# EAGLE design 3-Axis CNC Board v1.1_OSHPAK (EAGLE 6.5.0)
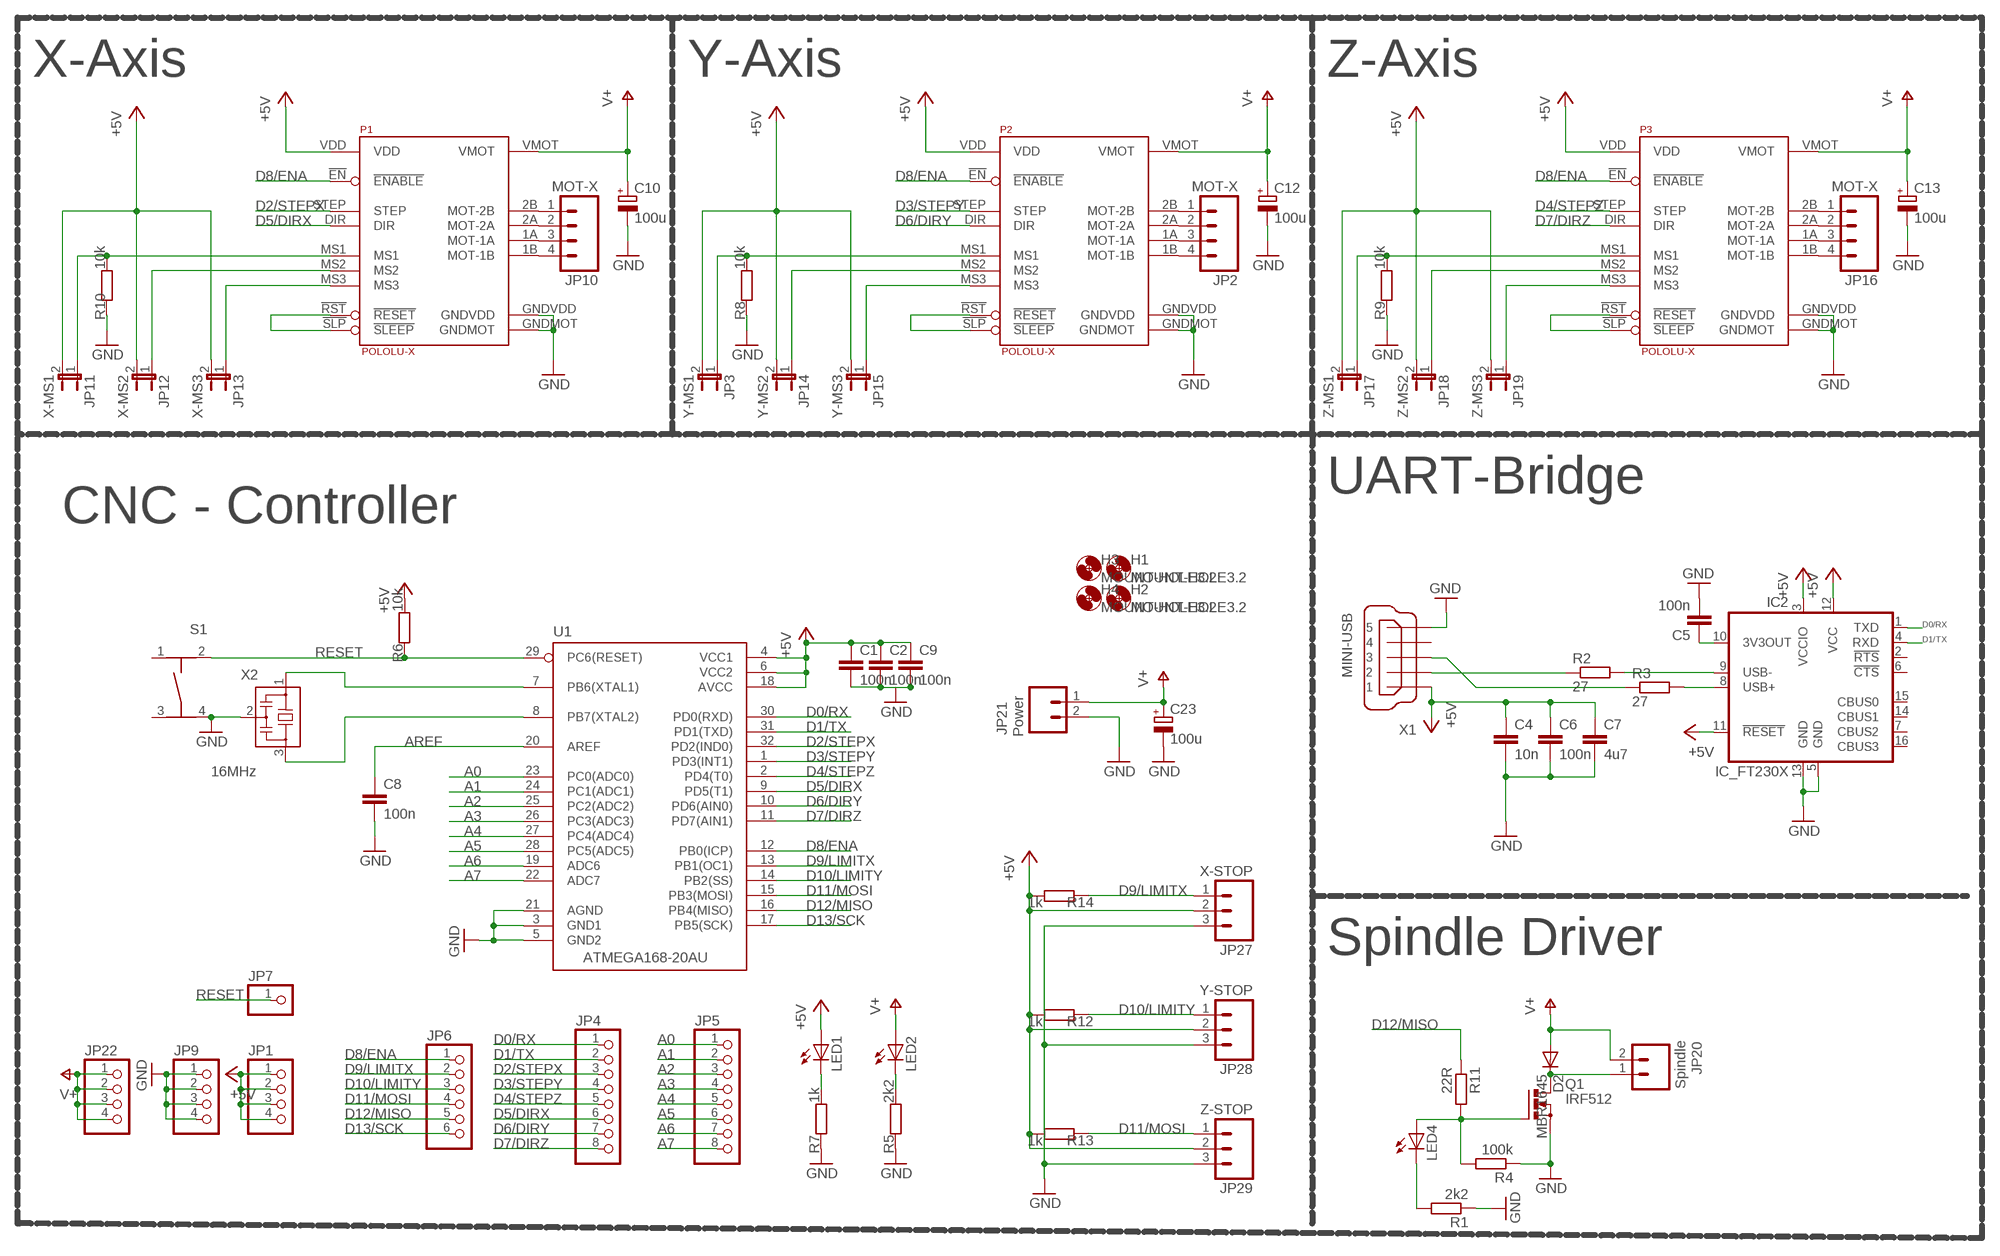
[diagram p0: schematic, sheet 1]

## Parts
C1  100n  C-EUC0805K  [C0805K]
C2  100n  C-EUC0805K  [C0805K]
C4  10n  C-EUC0805K  [C0805K]
C5  100n  C-EUC0805K  [C0805K]
C6  100n  C-EUC0805K  [C0805K]
C7  4u7  C-EUC0805K  [C0805K]
C8  100n  C-EUC0805K  [C0805K]
C9  100n  C-EUC0805K  [C0805K]
C10  100u  CPOL-EUUD-6,3X7,7  [UD-6,3X7,7_NICHICON]
C12  100u  CPOL-EUUD-6,3X7,7  [UD-6,3X7,7_NICHICON]
C13  100u  CPOL-EUUD-6,3X7,7  [UD-6,3X7,7_NICHICON]
C23  100u  CPOL-EUUD-6,3X7,7  [UD-6,3X7,7_NICHICON]
D2  MBR1645  BYT08P  [TO220ACS]
H1  MOUNT-HOLE3.2  [3,2]
H2  MOUNT-HOLE3.2  [3,2]
H3  MOUNT-HOLE3.2  [3,2]
H4  MOUNT-HOLE3.2  [3,2]
IC2  IC_FT230X  IC_FT230X-SSOP-16  [SSOP-16-FTDI]
JP1  PINHD-1X4_2.54  [1X04]
JP2  MOT-X  M04POLAR  [MOLEX-1X4]
JP3  Y-MS1  JUMPER-2PTH  [1X02]
JP4  PINHD-1X8_2.54  [1X08]
JP5  PINHD-1X8_2.54  [1X08]
JP6  PINHD-1X6_2.54  [1X06]
JP7  PINHD-1X1  [1X01]
JP9  PINHD-1X4_2.54  [1X04]
JP10  MOT-X  M04POLAR  [MOLEX-1X4]
JP11  X-MS1  JUMPER-2PTH  [1X02]
JP12  X-MS2  JUMPER-2PTH  [1X02]
JP13  X-MS3  JUMPER-2PTH  [1X02]
JP14  Y-MS2  JUMPER-2PTH  [1X02]
JP15  Y-MS3  JUMPER-2PTH  [1X02]
JP16  MOT-X  M04POLAR  [MOLEX-1X4]
JP17  Z-MS1  JUMPER-2PTH  [1X02]
JP18  Z-MS2  JUMPER-2PTH  [1X02]
JP19  Z-MS3  JUMPER-2PTH  [1X02]
JP20  Spindle  M025MM  [SCREWTERMINAL-5MM-2]
JP21  Power  M025MM  [SCREWTERMINAL-5MM-2]
JP22  PINHD-1X4_2.54  [1X04]
JP27  X-STOP  M03POLAR  [MOLEX-1X3]
JP28  Y-STOP  M03POLAR  [MOLEX-1X3]
JP29  Z-STOP  M03POLAR  [MOLEX-1X3]
LED1  LEDCHIPLED_1206  [CHIPLED_1206]
LED2  LEDCHIPLED_1206  [CHIPLED_1206]
LED4  LEDCHIPLED_1206  [CHIPLED_1206]
P1  POLOLU-X  POLOLU-ALLEGRO  [POLOLU-ALLEGRO-PTH]
P2  POLOLU-X  POLOLU-ALLEGRO  [POLOLU-ALLEGRO-PTH]
P3  POLOLU-X  POLOLU-ALLEGRO  [POLOLU-ALLEGRO-PTH]
Q1  IRF512  [TO220BV]
R1  2k2  R-EU_R1206  [R1206]
R2  27  R-EU_R1206  [R1206]
R3  27  R-EU_R1206  [R1206]
R4  100k  R-EU_R1206  [R1206]
R5  2k2  R-EU_R1206  [R1206]
R6  10k  R-EU_R1206  [R1206]
R7  1k  R-EU_R1206  [R1206]
R8  10k  R-EU_R1206  [R1206]
R9  10k  R-EU_R1206  [R1206]
R10  10k  R-EU_R1206  [R1206]
R11  22R  R-EU_R1206  [R1206]
R12  1k  R-EU_R1206  [R1206]
R13  1k  R-EU_R1206  [R1206]
R14  1k  R-EU_R1206  [R1206]
S1  TASTER-9314_SMD  [TASTER-9314_SMD]
U1  ATMEGA168-20AU  [QFP032]
X1  MINI-USB  MINI-USB-32005-021-NODRILL  [32005-201_1]
X2  16MHz  CSTCE_G8M00G52A  [CSTCE_]

## Nets
+5V: C1.1 C2.1 C4.1 C6.1 C7.1 C9.1 IC2.3(VCCIO) IC2.11(!RESET) IC2.12(VCC) JP1.1 JP1.2 JP1.3 JP1.4 JP3.2 JP11.2 JP12.2 JP13.2 JP14.2 JP15.2 JP17.2 JP18.2 JP19.2 JP27.2 JP28.2 JP29.2 LED1.A P1.VDD P2.VDD P3.VDD R6.2 R12.2 R13.2 R14.2 U1.4(VCC1) U1.6(VCC2) U1.18(AVCC) X1.1
A0: JP5.1 U1.23(PC0(ADC0))
A1: JP5.2 U1.24(PC1(ADC1))
A2: JP5.3 U1.25(PC2(ADC2))
A3: JP5.4 U1.26(PC3(ADC3))
A4: JP5.5 U1.27(PC4(ADC4))
A5: JP5.6 U1.28(PC5(ADC5))
A6: JP5.7 U1.19(ADC6)
A7: JP5.8 U1.22(ADC7)
AREF: C8.1 U1.20(AREF)
D0/RX: IC2.1(TXD) JP4.1 U1.30(PD0(RXD))
D1/TX: IC2.4(RXD) JP4.2 U1.31(PD1(TXD))
D2/STEPX: JP4.3 P1.STEP U1.32(PD2(IND0))
D3/STEPY: JP4.4 P2.STEP U1.1(PD3(INT1))
D4/STEPZ: JP4.5 P3.STEP U1.2(PD4(T0))
D5/DIRX: JP4.6 P1.DIR U1.9(PD5(T1))
D6/DIRY: JP4.7 P2.DIR U1.10(PD6(AIN0))
D7/DIRZ: JP4.8 P3.DIR U1.11(PD7(AIN1))
D8/ENA: JP6.1 P1.!EN(!ENABLE) P2.!EN(!ENABLE) P3.!EN(!ENABLE) U1.12(PB0(ICP))
D9/LIMITX: JP6.2 JP27.1 R14.1 U1.13(PB1(OC1))
D10/LIMITY: JP6.3 JP28.1 R12.1 U1.14(PB2(SS))
D11/MOSI: JP6.4 JP29.1 R13.1 U1.15(PB3(MOSI))
D12/MISO: JP6.5 R11.1 U1.16(PB4(MISO))
D13/SCK: JP6.6 U1.17(PB5(SCK))
D+: IC2.8(USB+) R3.2
D-: IC2.9(USB-) R2.2
GND: C1.2 C2.2 C4.2 C5.2 C6.2 C7.2 C8.2 C9.2 C10.- C12.- C13.- C23.- IC2.5(GND) IC2.13(GND) JP9.1 JP9.2 JP9.3 JP9.4 JP21.2 JP27.3 JP28.3 JP29.3 P1.GNDMOT P1.GNDVDD P2.GNDMOT P2.GNDVDD P3.GNDMOT P3.GNDVDD Q1.S R1.1 R4.1 R5.1 R7.1 R8.1 R9.1 R10.1 S1.4 U1.3(GND1) U1.5(GND2) U1.21(AGND) X1.5 X2.2
N$1: U1.8(PB7(XTAL2)) X2.3
N$2: U1.7(PB6(XTAL1)) X2.1
N$4: R3.1 X1.3
N$5: D2.C JP20.1 Q1.D
N$7: LED1.C R7.2
N$8: C5.1 IC2.10(3V3OUT)
N$9: R2.1 X1.2
N$10: LED4.C R1.2
N$11: LED4.A Q1.G R4.2 R11.2
N$17: LED2.C R5.2
RESET: JP7.1 R6.1 S1.2 U1.29(PC6(RESET))
V+: C10.+ C12.+ C13.+ C23.+ D2.A JP20.2 JP21.1 JP22.1 JP22.2 JP22.3 JP22.4 LED2.A P1.VMOT P2.VMOT P3.VMOT
X-MOT-1A [power]: JP10.3 P1.1A(MOT-1A)
X-MOT-1A1 [power]: JP2.3 P2.1A(MOT-1A)
X-MOT-1A2 [power]: JP16.3 P3.1A(MOT-1A)
X-MOT-1B [power]: JP10.4 P1.1B(MOT-1B)
X-MOT-1B1 [power]: JP2.4 P2.1B(MOT-1B)
X-MOT-1B2 [power]: JP16.4 P3.1B(MOT-1B)
X-MOT-2A [power]: JP10.2 P1.2A(MOT-2A)
X-MOT-2A1 [power]: JP2.2 P2.2A(MOT-2A)
X-MOT-2A2 [power]: JP16.2 P3.2A(MOT-2A)
X-MOT-2B [power]: JP10.1 P1.2B(MOT-2B)
X-MOT-2B1 [power]: JP2.1 P2.2B(MOT-2B)
X-MOT-2B2 [power]: JP16.1 P3.2B(MOT-2B)
X-MS1: JP11.1 P1.MS1 R10.2
X-MS2: JP12.1 P1.MS2
X-MS3: JP13.1 P1.MS3
X-MS4: JP14.1 P2.MS2
X-MS5: JP15.1 P2.MS3
X-MS6: JP3.1 P2.MS1 R8.2
X-MS7: JP18.1 P3.MS2
X-MS8: JP19.1 P3.MS3
X-MS9: JP17.1 P3.MS1 R9.2
X-RESETSLEEP: P1.!RST(!RESET) P1.!SLP(!SLEEP)
X-RESETSLEEP1: P2.!RST(!RESET) P2.!SLP(!SLEEP)
X-RESETSLEEP2: P3.!RST(!RESET) P3.!SLP(!SLEEP)
Unconnected: IC2.2(!RTS) IC2.6(!CTS) IC2.7(CBUS2) IC2.14(CBUS1) IC2.15(CBUS0) IC2.16(CBUS3) S1.1 S1.3 X1.4

## Notes on the sheet
- X-Axis | Y-Axis | Z-Axis
- UART-Bridge
- CNC - Controller
- Spindle Driver

## Library data of the parts
C1 C2 C4-C9 = rcl:C-EU: CAPACITOR, European symbol
C10 C12 C13 C23 = rcl:CPOL-EU: POLARIZED CAPACITOR, European symbol
D2 = diode:BYT08P: DIODE ultra fast
H1-H4 = holes:MOUNT-HOLE: MOUNTING HOLE with drill center marker
IC2 = dp_devices:IC_FT230X: BASIC USB to UART IC
JP1 JP9 JP22 = pinhead-1:PINHD-1X4: PIN HEADER
JP2 JP10 JP16 = SparkFun:M04: Header 4 Standard 4-pin 0.1" header. Use with straight break away headers (SKU : PRT-00116), right angle break away headers (PRT-00553), swiss pins (PRT-00743), machine pins (PRT-00117), and female headers (PRT-00115). Molex polarized connector foot print use with SKU : PRT-08231 with associated crimp pins and housings.
JP3 JP11-JP15 JP17-JP19 = SparkFun:JUMPER-2: Jumper Basic 0.1" spaced jumper. Use with breakaway headers.
JP4 JP5 = pinhead-1:PINHD-1X8: PIN HEADER
JP6 = pinhead-1:PINHD-1X6: PIN HEADER
JP7 = pinhead:PINHD-1X1: PIN HEADER
JP20 JP21 = SparkFun-Connectors:M02: Standard 2-pin 0.1" header. Use with - straight break away headers ( PRT-00116) - right angle break away headers (PRT-00553) - swiss pins (PRT-00743) - machine pins (PRT-00117) - female headers (PRT-00115) Molex polarized connector foot print use with: PRT-08233 with associated crimp pins and housings. 2.54_SCREWTERM for use with PRT-10571. 3.5mm Screw Terminal footprints for PRT-08084 5mm Screw Terminal footprints for use with PRT-08433
JP27-JP29 = SparkFun:M03: Header 3 Standard 3-pin 0.1" header. Use with straight break away headers (SKU : PRT-00116), right angle break away headers (PRT-00553), swiss pins (PRT-00743), machine pins (PRT-00117), and female headers (PRT-00115). Molex polarized connector foot print use with SKU : PRT-08232 with associated crimp pins and housings.
LED1 LED2 LED4 = led:LED: LED OSRAM: - CHIPLED LG R971, LG N971, LY N971, LG Q971, LY Q971, LO R971, LY R971 LH N974, LH R974 LS Q976, LO Q976, LY Q976 LO Q996 - Hyper CHIPLED LW Q18S LB Q993, LB Q99A, LB R99A - SideLED LS A670, LO A670, LY A670, LG A670, LP A670 LB A673, LV A673, LT A673, LW A673 LH A674 LY A675 LS A676, LA A676, LO A676, LY A676, LW A676 LS A679, LY A679, LG A679 - Hyper Micro SIDELED® LS Y876, LA Y876, LO Y876, LY Y876 LT Y87S - SmartLED LW L88C, LW L88S LB L89C, LB L89S, LG L890 LS L89K, LO L89K, LY L89K LS L896, LA L896, LO L896, LY L896 - TOPLED LS T670, LO T670, LY T670, LG T670, LP T670 LSG T670, LSP T670, LSY T670, LOP T670, LYG T670 LG T671, LOG T671, LSG T671 LB T673, LV T673, LT T673, LW T673 LH T674 LS T676, LA T676, LO T676, LY T676, LB T676, LH T676, LSB T676, LW T676 LB T67C, LV T67C, LT T67C, LS T67K, LO T67K, LY T67K, LW E67C LS E67B, LA E67B, LO E67B, LY E67B, LB E67C, LV E67C, LT E67C LW T67C LS T679, LY T679, LG T679 LS T770, LO T770, LY T770, LG T770, LP T770 LB T773, LV T773, LT T773, LW T773 LH T774 LS E675, LA E675, LY E675, LS T675 LS T776, LA T776, LO T776, LY T776, LB T776 LHGB T686 LT T68C, LB T68C - Hyper Mini TOPLED® LB M676 - Mini TOPLED Santana® LG M470 LS M47K, LO M47K, LY M47K Source: http://www.osram.convergy.de LUXEON: - LUMILED® LXK2-PW12-R00, LXK2-PW12-S00, LXK2-PW14-U00, LXK2-PW14-V00 LXK2-PM12-R00, LXK2-PM12-S00, LXK2-PM14-U00 LXK2-PE12-Q00, LXK2-PE12-R00, LXK2-PE12-S00, LXK2-PE14-T00, LXK2-PE14-U00 LXK2-PB12-K00, LXK2-PB12-L00, LXK2-PB12-M00, LXK2-PB14-N00, LXK2-PB14-P00, LXK2-PB14-Q00 LXK2-PR12-L00, LXK2-PR12-M00, LXK2-PR14-Q00, LXK2-PR14-R00 LXK2-PD12-Q00, LXK2-PD12-R00, LXK2-PD12-S00 LXK2-PH12-R00, LXK2-PH12-S00 LXK2-PL12-P00, LXK2-PL12-Q00, LXK2-PL12-R00 Source: www.luxeon.com KINGBRIGHT: KA-3528ASYC Source: www.kingbright.com
P1-P3 = pololu-allegro:POLOLU-ALLEGRO
Q1 = transistor-power:IRF512: N-CHANNEL MOS FET
R1-R14 = rcl:R-EU_: RESISTOR, European symbol
S1 = SMD-taster:TASTER-9314_SMD
U1 = MySMD:ATMEGA168-20AU
X1 = con-cypressindustries:MINI-USB-: MINI USB-B Conector Source: www.cypressindustries.com
X2 = DragonLib:CSTCE_G: Resonator Source: murata.co.jp; MPN: CSTCE8M00G52-R0; OC_RS: 721-4827

## Board
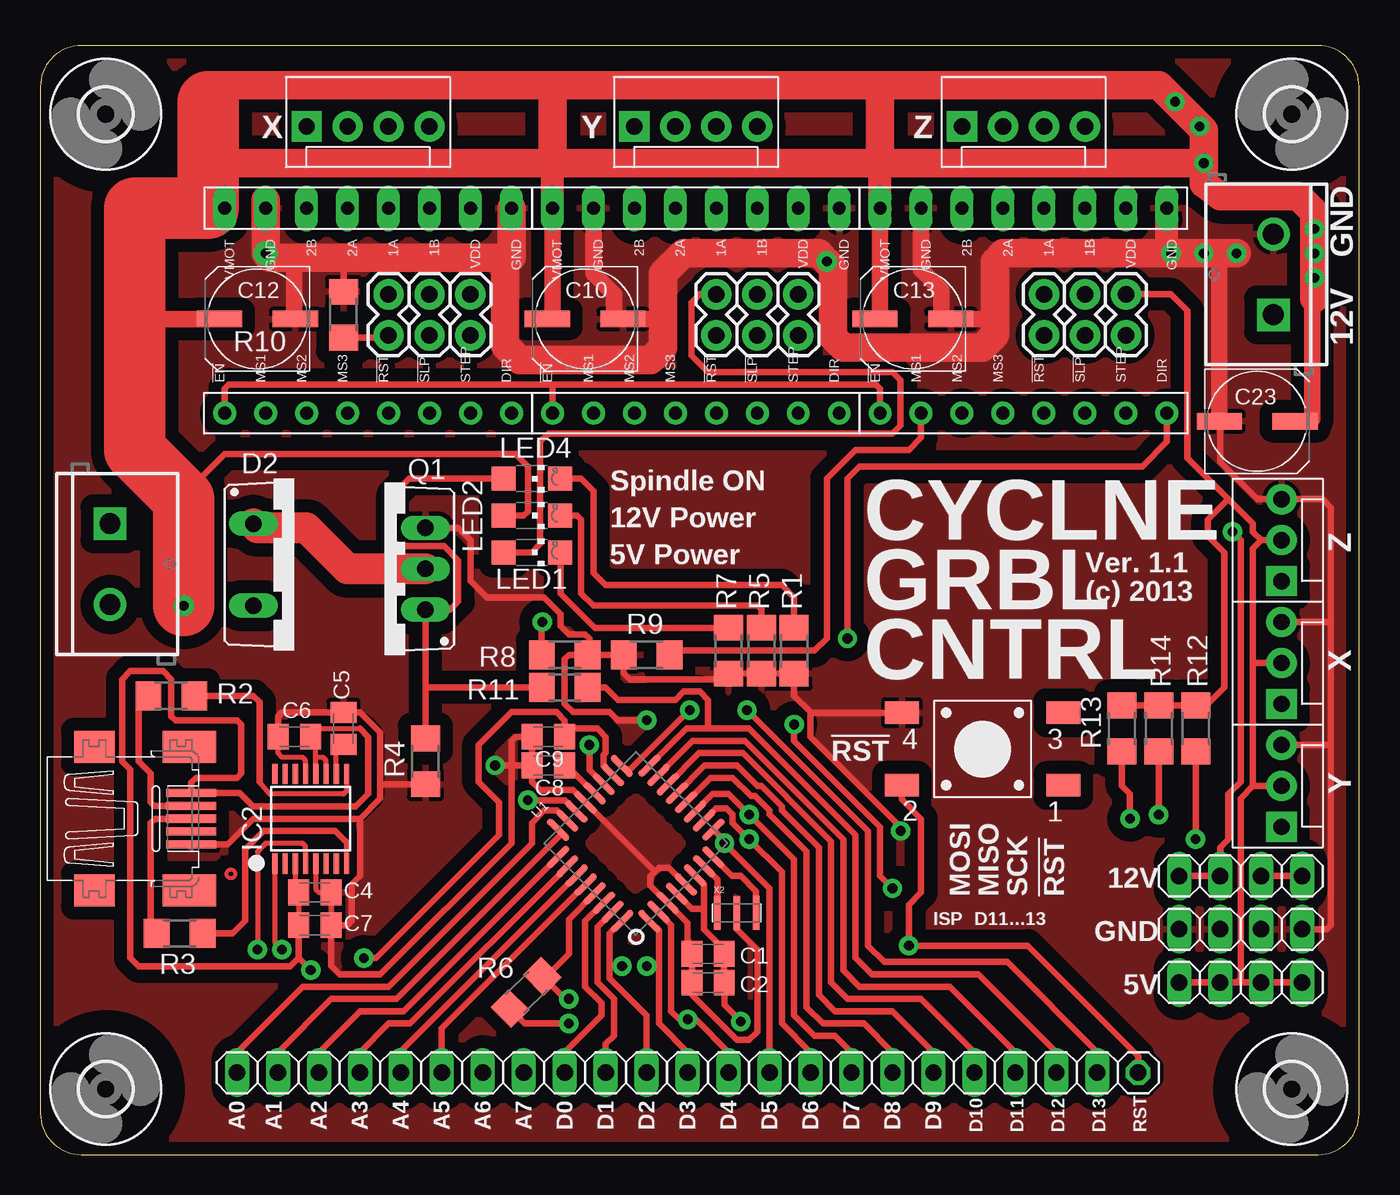
[diagram p1: board, top side]
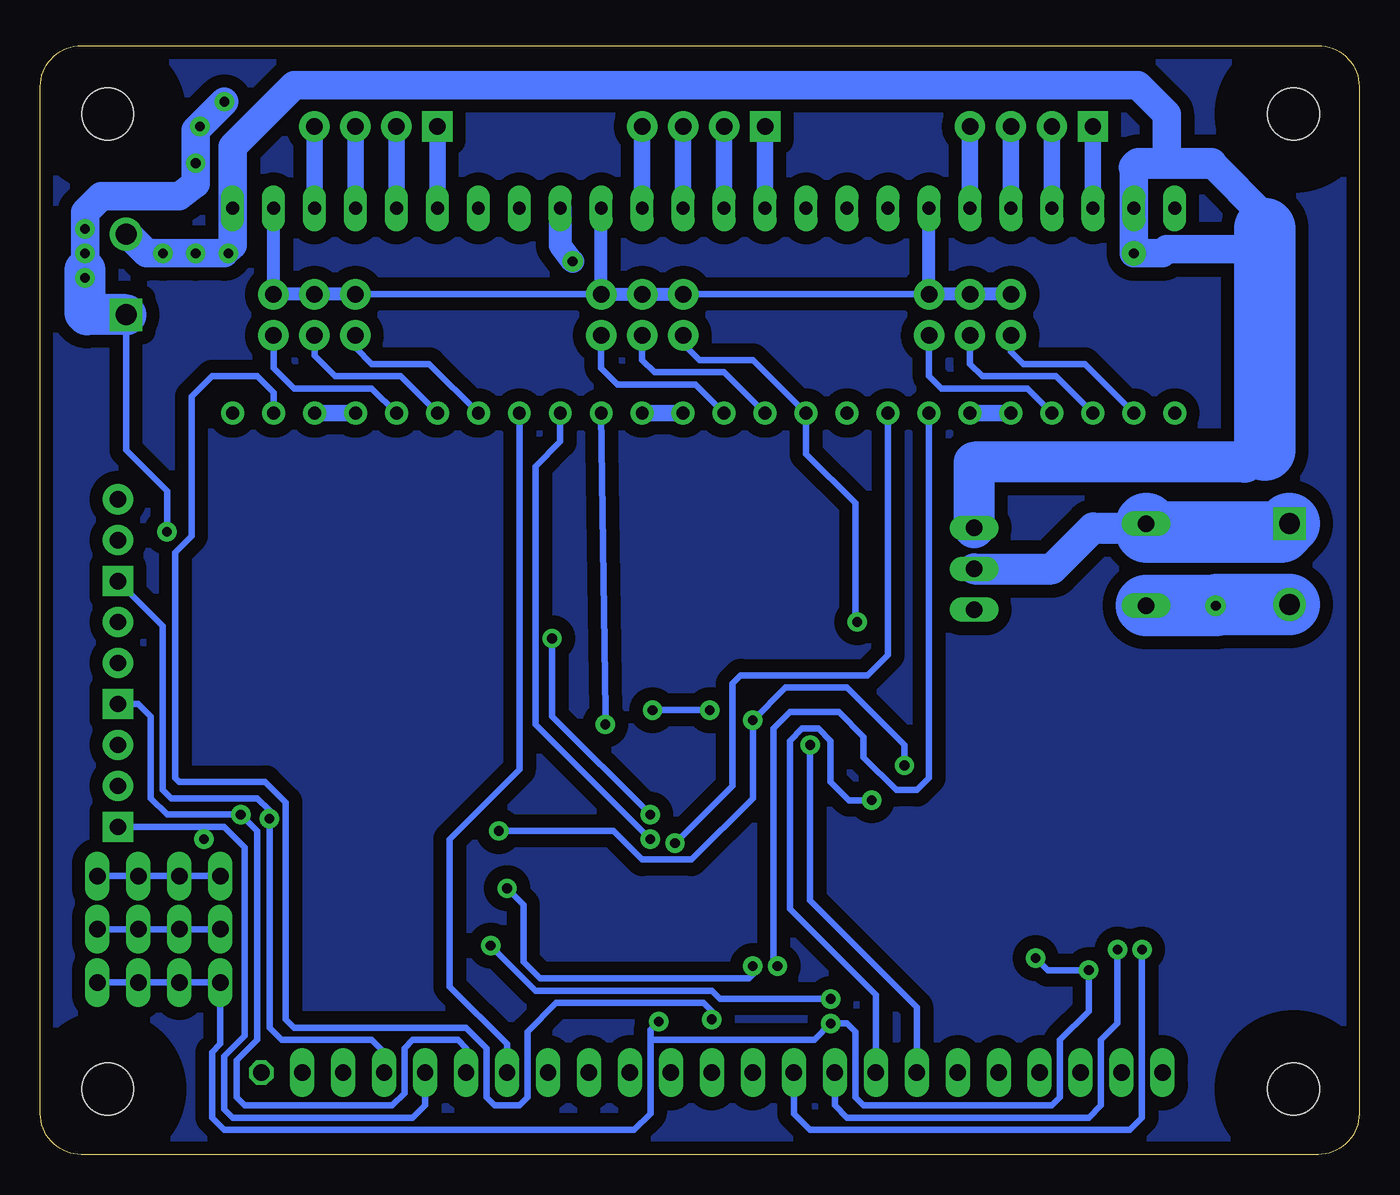
[diagram p2: board, bottom side, seen from below]

Size 81.77 x 68.76 mm. Coordinates in mm from the lower left corner, seen from the top.
Outline: 81.77,2.54 81.77,66.22 arc90 79.23,68.76 2.54,68.76 arc90 0,66.22 0,2.54 arc90 2.54,0 79.23,0 arc90 81.77,2.54
Copper layers (1*16): Top 0.035mm / dielectric 1.5mm / Bottom 0.035mm
Design rules "OSHPAK": minimum track width 6mil, minimum drill 13mil, track to track 6mil, track to pad 6mil, pad to pad 6mil, via to via 6mil, smd to smd 0mil, copper to edge 20mil, drill to drill 2mil, minimum pad ring 10mil, minimum via ring 8mil, stop-mask expansion 4mil, vias tented up to drill 0mil, thermal gap 10mil

### Footprints (pad centres in the part's own frame; a part is rotated, then mirrored left to right if it is on the bottom)
C0805K = smd 1.3 x 1.6: 1 -1,0; 2 1,0
UD-6,3X7,7_NICHICON = smd 2.8 x 1: + 2.35,0; - -2.35,0
TO220ACS = drill 1.016 long: A 2.54,-2.54; C -2.54,-2.54
3,2 = hole 3.2: 0,0
SSOP-16-FTDI = smd 0.32 x 1.26: 1 -2.223,-2.779; 2 -1.588,-2.779; 3 -0.953,-2.779; 4 -0.318,-2.779; 5 0.317,-2.779; 6 0.952,-2.779; 7 1.587,-2.779; 8 2.222,-2.779; 9 2.222,2.779; 10 1.587,2.779; 11 0.952,2.779; 12 0.317,2.779; 13 -0.318,2.779; 14 -0.953,2.779; 15 -1.588,2.779; 16 -2.223,2.779
1X04 = drill 1.016 long: 1 -3.81,0; 2 -1.27,0; 3 1.27,0; 4 3.81,0
MOLEX-1X4 = drill 1.016 pad 1.88 square: 1 0,0 | drill 1.016 pad 1.88: 2 2.54,0; 3 5.08,0; 4 7.62,0
1X02 = drill 1.016 pad 1.88: 1 0,0; 2 2.54,0
1X08 = drill 1.016 long: 1 -8.89,0; 2 -6.35,0; 3 -3.81,0; 4 -1.27,0; 5 1.27,0; 6 3.81,0; 7 6.35,0; 8 8.89,0
1X06 = drill 1.016 long: 1 -6.35,0; 2 -3.81,0; 3 -1.27,0; 4 1.27,0; 5 3.81,0; 6 6.35,0
1X01 = drill 1.016 octagon: 1 0,0
SCREWTERMINAL-5MM-2 = drill 1.3 pad 2.032 square: 1 0,0 | drill 1.3 pad 2.032: 2 5,0
MOLEX-1X3 = drill 1.016 pad 1.88 square: 1 0,0 | drill 1.016 pad 1.88: 2 2.54,0; 3 5.08,0
CHIPLED_1206 = smd 1.5 x 1.5: A 0,-1.75; C 0,1.75
POLOLU-ALLEGRO-PTH = drill 0.8 pad 1.422 long: 1A 6.35,-1.27; 1B 6.35,-3.81; 2A 6.35,1.27; 2B 6.35,3.81; GNDMOT 6.35,6.35; GNDVDD 6.35,-8.89; VDD 6.35,-6.35; VMOT 6.35,8.89 | drill 0.8 pad 1.422: !EN -6.35,8.89; !RST -6.35,-1.27; !SLP -6.35,-3.81; DIR -6.35,-8.89; MS1 -6.35,6.35; MS2 -6.35,3.81; MS3 -6.35,1.27; STEP -6.35,-6.35
TO220BV = drill 1.016 long: D 0,-2.54; G -2.54,-2.54; S 2.54,-2.54
R1206 = smd 1.6 x 1.803: 1 -1.422,0; 2 1.422,0
TASTER-9314_SMD = smd 2.1 x 1.4: 1 -5,2.25; 2 5,2.25; 3 -5,-2.25; 4 5,-2.25
QFP032 = smd 0.432 x 1.778: 1 0,0; 2 0.8,0; 3 1.599,0; 4 2.399,0; 5 3.199,0; 6 3.998,0; 7 4.798,0; 8 5.598,0; 17 5.588,8.001; 18 4.798,7.997; 19 3.998,7.997; 20 3.199,7.997; 21 2.399,7.997; 22 1.599,7.997; 23 0.799,7.997; 24 0,7.997 | smd 1.778 x 0.432: 9 6.807,1.194; 10 6.807,2.007; 11 6.807,2.794; 12 6.807,3.607; 13 6.807,4.394; 14 6.807,5.182; 15 6.807,5.994; 16 6.816,6.803; 25 -1.194,6.807; 26 -1.194,5.994; 27 -1.194,5.182; 28 -1.194,4.394; 29 -1.194,3.607; 30 -1.194,2.794; 31 -1.194,2.007; 32 -1.194,1.194
32005-201_1 = smd 3.1 x 0.5: 1 3,1.6; 2 3,0.8; 3 3,0; 4 3,-0.8; 5 3,-1.6 | smd 2.5 x 2: M1 -3,-4.45; M2 -3,4.45 | smd 3.3 x 2: M3 2.9,4.45; M4 2.9,-4.45
CSTCE_ = smd 0.4 x 2.1: 1 -1.2,0; 2 0,0; 3 1.2,0

### Placement (x,y rotation side)
C1  41.4,12.45 180 top
C2  41.4,10.67 180 top
C4  17.02,16.26 0 top
C5  18.8,26.42 90 top
C6  15.75,25.91 180 top
C7  17.02,14.22 0 top
C8  31.5,24.13 180 top
C9  31.5,25.91 180 top
C10  33.78,51.82 180 top
C12  13.46,51.82 180 top
C13  54.1,51.82 180 top
C23  75.44,45.47 0 top
D2  15.75,36.58 270 top
H1  77.6,64.52 90 top
H2  4.06,64.52 0 top
H3  77.6,4.06 0 top
H4  4.06,4.06 0 top
IC2  16.76,20.83 0 top
JP1  74.42,10.67 180 top
JP2  36.83,63.75 0 top
JP3  41.91,50.8 90 top
JP4  41.4,5.08 0 top
JP5  21.08,5.08 0 top
JP6  59.18,5.08 0 top
JP7  68.07,5.08 0 top
JP9  74.42,13.97 180 top
JP10  16.51,63.75 0 top
JP11  21.59,50.8 90 top
JP12  24.13,50.8 90 top
JP13  26.67,50.8 90 top
JP14  44.45,50.8 90 top
JP15  46.99,50.8 90 top
JP16  57.15,63.75 0 top
JP17  62.23,50.8 90 top
JP18  64.77,50.8 90 top
JP19  67.31,50.8 90 top
JP20  4.32,39.12 270 top
JP21  76.45,52.07 90 top
JP22  74.42,17.27 180 top
JP27  76.96,27.94 90 top
JP28  76.96,20.32 90 top
JP29  76.96,35.56 90 top
LED1  30.48,37.34 270 top
LED2  30.48,39.62 270 top
LED4  30.48,41.91 270 top
P1  20.32,52.32 90 top
P2  40.64,52.32 90 top
P3  60.96,52.32 90 top
Q1  21.34,36.32 90 top
R1  46.74,31.24 90 top
R2  8.13,28.45 0 top
R3  8.64,13.72 0 top
R4  23.88,24.38 90 top
R5  44.7,31.24 90 top
R6  30.12,10.05 225 top
R7  42.67,31.24 90 top
R8  32.51,30.99 180 top
R9  37.59,30.99 0 top
R10  18.8,52.07 270 top
R11  32.51,28.96 180 top
R12  71.63,26.42 90 top
R13  67.06,26.42 90 top
R14  69.34,26.42 90 top
S1  58.42,25.15 180 top
U1  37.76,14.49 45 top
X1  6.35,20.83 0 top
X2  43.18,14.99 0 top

### Tracks (layer width: path | path; a pad name or v marks a point on that pad's centre or on a via)
+5V  (via drill 0.6 pad 1.2)
  Top 0.305: IC2.3 15.81,16.46 C4.1 C7.1 | IC2.12 17.08,24.64 | 17.08,24.64 17.08,25.58 C6.1 16.75,26.15 17.02,26.42 19.81,26.42 | IC2.11 17.72,24.45 17.53,24.64 17.08,24.64
  Top 0.406: U1.6 41.15,16.75 41.15,15.24 | U1.4 40.4,15.24 41.15,15.24 | 41.15,15.24 41.15,13.97 42.4,12.72 C1.1 C2.1 42.42,10.65 42.42,9.27 v43.43,8.25 | U1.18 34.93,24.1 34.93,24.77 35.05,24.89 35.05,25.91 34.54,26.42 33.02,26.42 32.77,25.91 C9.1 32.51,25.92 32.51,26.92 32,27.43 29.21,27.43 27.18,25.4 27.18,23.11 28.45,21.84 28.45,19.81 20.83,12.19 v20.07,12.19 | R6.2 30.04,8.13 v32.77,8.13 | 19.81,26.42 20.32,25.91 20.32,22.35 19.56,21.59 13.21,21.59 12.37,22.43 X1.1 9.35,23.07 9.65,23.37 12.19,23.37 12.45,23.62 12.45,26.67 12.19,26.92 8.38,26.92 8.13,27.18 8.13,29.46 7.62,29.97 5.59,29.97 5.08,29.46 5.08,24.38 5.59,23.88 5.59,12.19 6.1,11.68 15.49,11.68 16,12.19 | 16,12.19 16,14.21 C7.1 | 16,12.19 v16.76,11.43 | JP1.3 74.17,10.67 74.42,10.92 74.42,22.1 75.18,22.86 | JP3.2 40.89,53.34 40.39,52.83 40.39,49.53 41.4,48.51 52.83,48.51 53.34,48.01 53.34,45.21 52.83,44.7 31.5,44.7 30.99,44.2 30.99,37.85 30.48,37.34 LED1.A | JP19.2 70.1,53.34 71.12,52.32 71.12,43.18 73.66,40.64 | JP28.2 75.18,22.86 | 75.18,22.86 75.18,30.48 | 75.18,30.48 75.18,37.59 75.69,38.1 | 75.69,38.1 JP29.2 | JP27.2 75.18,30.48 | 75.69,38.1 75.18,38.61 75.18,39.12 73.66,40.64 | R14.2 R13.2 R12.2 72.29,27.84 73.41,28.96 73.41,37.34 72.39,38.35 72.39,39.37 73.66,40.64 | JP1.4 JP1.1
  Bottom 0.406: v20.07,12.19 19.3,11.43 v16.76,11.43 16.76,8.89 18.54,7.11 18.54,3.56 19.05,3.05 30.73,3.05 31.24,3.56 31.24,7.62 31.75,8.13 v32.77,8.13 33.78,7.11 43.94,7.11 | v43.43,8.25 43.94,7.75 43.94,7.11 | 43.94,7.11 43.94,2.54 44.96,1.52 70.36,1.52 71.12,2.29 71.12,6.35 70.61,6.86 JP1.4 JP1.3 JP1.2 JP1.1 | JP13.2 JP3.2 | JP15.2 JP17.2
  Bottom 0.813: JP17.2 JP18.2 JP19.2 P3.VDD | JP3.2 JP14.2 JP15.2 P2.VDD | JP11.2 JP12.2 JP13.2 P1.VDD
A0
  Top 0.406: JP5.1 12.19,6.35 16.26,10.41 21.59,10.41 30.48,19.3 30.48,20.57 31.24,21.34 32.04,21.34 U1.23
A1
  Top 0.406: U1.24 32.26,19.99 32.26,19.81 22.1,9.65 18.03,9.65 14.73,6.35 JP5.2
A2
  Top 0.406: U1.25 22.54,8.89 19.81,8.89 17.27,6.35 JP5.3
A3
  Top 0.406: U1.26 22.92,8.13 21.59,8.13 19.81,6.35 JP5.4
A4
  Top 0.406: U1.27 22.35,6.41 JP5.5
A5
  Top 0.406: U1.28 24.89,7.83 JP5.6
A6  (via drill 0.6 pad 1.2)
  Top 0.406: U1.19 34.04,23.86 v34.04,25.4
  Bottom 0.406: v34.04,25.4 34.04,15.75 27.43,9.14 JP5.7
A7  (via drill 0.6 pad 1.2)
  Top 0.406: U1.22 32.54,21.97 v30.23,21.97
  Bottom 0.406: v30.23,21.97 31.62,21.97 32.77,23.11 32.77,25.65 33.53,26.42 34.54,26.42 35.31,25.65 35.31,15.24 29.97,9.91 JP5.8
AREF
  Top 0.406: U1.20 32.75,24.02 C8.1
D0/RX  (via drill 0.6 pad 1.2)
  Top 0.305: IC2.1 14.54,13.14 v14.99,12.7
  Top 0.406: JP4.1 32.51,6.35 34.8,8.64 34.8,9.4 33.78,10.41 33.78,14.48 34.92,15.62 U1.30
  Bottom 0.406: v14.99,12.7 14.99,8.13 16,7.11 16,3.05 16.76,2.29 31.75,2.29 32.51,3.05 JP4.1
D1/TX  (via drill 0.6 pad 1.2)
  Top 0.305: IC2.4 16.45,19.11 16.26,19.3 13.97,19.3 13.46,18.8 v13.46,12.7
  Top 0.406: U1.31 34.54,14.11 34.54,10.67 35.56,9.65 35.56,7.37 35.05,6.86 JP4.2
  Bottom 0.406: v13.46,12.7 13.46,2.29 14.22,1.52 34.04,1.52 35.05,2.54 JP4.2
D2/STEPX  (via drill 0.6 pad 1.2)
  Top 0.406: U1.32 35.31,13.72 35.31,11.68 | 35.31,11.68 35.31,10.92 37.59,8.64 JP4.3 | v36.07,11.68 35.31,11.68
  Bottom 0.406: P1.STEP 26.67,23.37 27.43,22.61 28.7,22.61 30.73,24.64 30.73,25.91 32.26,27.43 35.31,27.43 36.32,26.42 36.32,11.94 v36.07,11.68
D3/STEPY  (via drill 0.6 pad 1.2)
  Top 0.406: JP4.4 40.13,6.35 38.35,8.13 38.35,11.68 | 38.35,11.68 38.35,13.89 U1.1 | 38.35,11.68 v37.59,11.68 | v52.83,16.51 52.07,17.27 52.07,20.32 46.74,25.65 v46.74,26.67
  Bottom 0.406: P2.STEP 46.74,27.43 v46.74,26.67 | v37.59,11.68 37.59,11.18 37.85,10.92 50.8,10.92 51.82,11.94 51.82,15.49 v52.83,16.51
D4/STEPZ  (via drill 0.6 pad 1.2)
  Top 0.406: JP4.5 42.67,6.35 40.64,8.38 v40.13,8.38 39.62,8.38 39.12,8.89 39.12,14.26 U1.2
  Bottom 0.406: v40.13,8.38 40.13,8.89 40.64,9.4 49.78,9.4 51.56,7.62 51.56,3.56 52.07,3.05 53.59,3.05 54.1,3.56 54.1,6.6 55.37,7.87 66.04,7.87 66.55,8.38 66.55,21.84 67.82,23.11 73.15,23.11 73.41,23.37 73.41,37.34 72.39,38.35 72.39,46.99 71.12,48.26 68.33,48.26 67.31,47.24 P3.STEP
D5/DIRX  (via drill 0.6 pad 1.2)
  Top 0.406: U1.9 42.42,19.45 v42.42,19.3 45.21,16.51 JP4.6
  Bottom 0.406: P1.DIR 29.21,30.99 30.48,29.72 38.35,29.72 38.86,29.21 38.86,22.86 v42.42,19.3
D6/DIRY  (via drill 0.6 pad 1.2)
  Top 0.406: JP4.7 47.75,6.35 45.97,8.13 45.97,17.53 v43.94,19.56 42.93,20.57 42.93,21.08 42.55,21.46 41.9,21.46 U1.10
  Bottom 0.406: v43.94,19.56 51.05,26.67 51.05,42.67 49.53,44.2 P2.DIR
D7/DIRZ  (via drill 0.6 pad 1.2)
  Top 0.406: JP4.8 50.29,6.35 49.28,7.37 48.01,7.37 46.74,8.64 46.74,18.29 v43.94,21.08 42.67,22.35 41.67,22.35 U1.11 | v50.04,32 50.04,41.91 50.8,42.67 68.33,42.67 69.85,44.2 P3.DIR
  Bottom 0.406: v43.94,21.08 50.04,27.18 v50.04,32
D8/ENA
  Top 0.406: 31.75,47.75 11.68,47.75 11.43,47.5 P1.!EN | 31.75,47.75 51.82,47.75 52.07,47.5 P3.!EN | JP6.1 52.83,6.35 51.05,8.13 48.51,8.13 47.5,9.14 47.5,18.8 45.21,21.08 45.21,21.34 44.32,22.23 44.07,22.23 42.93,23.37 41.54,23.37 U1.12 | 31.75,47.75 P2.!EN
  Bottom 0.406: P3.!EN 52.07,23.88 56.39,19.56 56.39,10.41 52.83,6.86 JP6.1
D9/LIMITX  (via drill 0.6 pad 1.2)
  Top 0.406: JP6.2 55.37,6.35 52.83,8.89 49.28,8.89 48.26,9.91 48.26,19.05 45.97,21.34 45.97,21.59 44.7,22.86 44.45,22.86 43.18,24.13 41.19,24.13 U1.13 | R14.1 v69.34,21.08
  Bottom 0.406: JP27.1 75.69,27.94 74.93,27.18 74.93,22.1 73.91,21.08 v69.34,21.08 68.33,20.07 68.33,7.11 69.6,5.84 69.6,3.56 69.09,3.05 59.94,3.05 59.18,3.81 59.18,6.6 58.67,7.11 55.88,7.11 55.37,6.6 JP6.2
D10/LIMITY  (via drill 0.6 pad 1.2)
  Top 0.406: JP6.3 57.91,6.35 54.61,9.65 50.04,9.65 49.02,10.67 49.02,19.43 43.56,24.89 40.84,24.89 U1.14 | R12.1 v71.63,19.56
  Bottom 0.406: JP28.1 71.63,20.32 | 71.63,20.32 70.36,20.32 69.09,19.05 69.09,7.37 70.36,6.1 70.36,2.79 69.85,2.29 58.67,2.29 57.91,3.05 JP6.3 | v71.63,19.56 71.63,20.32
D11/MOSI  (via drill 0.6 pad 1.2)
  Top 0.406: JP6.4 60.45,6.35 56.39,10.41 50.8,10.41 49.78,11.43 49.78,19.56 43.69,25.65 40.45,25.65 U1.15 | v67.56,20.83 67.56,22.35 67.06,22.86 R13.1
  Bottom 0.406: JP29.1 74.17,32.77 74.17,22.61 73.66,22.1 68.33,22.1 67.56,21.34 v67.56,20.83 67.56,7.87 66.8,7.11 61.21,7.11 60.45,6.35 JP6.4
D12/MISO
  Top 0.406: JP6.5 62.99,6.35 58.17,11.18 51.56,11.18 50.55,12.19 50.55,19.81 43.94,26.42 41.4,26.42 | 41.4,26.42 40.07,26.42 U1.16 | 41.4,26.42 41.4,28.19 40.89,28.7 39.88,28.7 39.37,28.19 35.81,28.19 35.05,28.96 R11.1
D13/SCK  (via drill 0.6 pad 1.2)
  Top 0.406: JP6.6 65.53,6.35 59.94,11.94 52.32,11.94 51.31,12.95 51.31,20.07 v43.82,27.56 | v40.26,27.56 36.58,23.88 36.27,23.88 U1.17
  Bottom 0.406: v40.26,27.56 v43.82,27.56
D+
  Top 0.305: IC2.8 18.99,19.37 18.8,19.56
  Top 0.406: R3.2 11.94,13.72 12.7,14.48 12.7,18.92 13.84,20.07 18.29,20.07 18.99,19.37
D-
  Top 0.305: IC2.9 18.99,22.54 18.8,22.35 14.22,22.35 13.59,23.11
  Top 0.406: 13.59,23.11 13.59,28.07 13.21,28.45 R2.2
GND  (via drill 0.6 pad 1.2, 0.6 pad 1.27, 0.6 pad 1.5)
  Top 0.305: IC2.5 17.08,16.45 17.27,16.26 C4.2 C7.2 | IC2.13 16.45,24.45 16.26,24.64 14.99,24.64 14.73,24.89 14.73,25.89 C6.2
  Top 0.406: U1.5 38.99,17.78 38.35,17.78 38.1,17.53 | 38.1,17.53 37.85,17.27 37.85,16.66 U1.3 40.13,14.37 40.13,12.95 40.4,12.68 C1.2 C2.2 40.4,9.89 43.18,7.11 43.94,7.11 44.45,7.62 44.45,12.7 43.18,13.97 X2.2 | 38.1,17.53 38.1,17.54 U1.21 33.03,22.61 30.99,22.61 30.5,23.1 C8.2 C9.2 29.46,25.91 29.21,25.65 29.21,24.13 | 21.08,22.86 21.08,26.16 19.83,27.42 C5.2 14.97,27.42 14.73,27.18 14.73,25.92 C6.2 | 21.08,22.86 21.08,22.1 19.81,20.83 | 19.81,20.83 13.21,20.83 11.61,19.23 X1.5 | 19.81,20.83 19.81,17.27 19.3,16.76 19.3,14.48 19.05,14.22 C7.2 18.02,11.7 18.54,11.18 21.08,11.18 29.21,19.3 29.21,24.13 | 29.21,24.13 30.48,24.13 | v28.19,24.13 29.21,24.13 | C23.- 73.15,45.4 73.15,42.93 75.44,40.64 JP29.3 79.5,40.64 80.01,40.13 80.01,33.02 | 80.01,33.02 80.01,25.4 | 80.01,25.4 80.01,14.22 79.76,13.97 JP9.1 | R5.1 R7.1 | R7.1 R1.1 46.74,28.45 47.75,27.43 | v37.59,26.92 35.81,26.92 35.31,27.43 33.02,27.43 32.51,27.94 32.51,30.73 32.77,30.99 R8.1 | R8.1 R9.1 36.17,29.87 36.58,29.46 42.32,29.46 R7.1 | R10.1 18.8,55.63 | Q1.S 25.91,38.86 26.67,38.1 26.67,35.56 27.69,34.54 31.24,34.54 32.26,33.53 32.26,32.77 32.77,32.26 33.78,32.26 34.04,32 34.04,31.09 R8.1 | JP28.3 80.01,25.4 | JP27.3 80.01,33.02 | 47.75,27.43 47.79,27.4 S1.4 | v53.34,20.07 53.34,20.32 47.75,25.91 47.75,27.43 | R4.1 21.18,22.96 21.08,22.86
  Top 0.813: v13.97,55.88 14.73,55.88 | 15.75,51.88 C12.-
  Top 1.016: C23.- 73.09,55.82 73.15,55.88 | 15.75,51.88 15.75,55.63 | 38.61,51.82 C10.- 35.56,51.82 35.56,53.34 34.29,54.61 P2.GNDMOT | 59.18,51.82 C13.- 55.88,51.82 55.88,53.59 54.61,54.86 P3.GNDMOT
  Top 1.422: 69.85,55.88 P3.GNDVDD
  Top 1.778: v74.17,55.88 73.15,55.88 v72.14,55.88 v70.1,55.88 69.85,55.88 59.69,55.88 59.18,55.37 59.18,51.82 59.18,50.8 58.42,50.04 49.78,50.04 49.15,50.67 49.15,54.99 v48.77,55.37 48.26,55.88 39.88,55.88 38.61,54.61 38.61,51.82 38.61,50.04 37.85,49.28 29.72,49.28 28.83,50.16 28.83,55.75 28.96,55.88 | 13.97,59.18 v13.97,55.88 14.22,55.63 15.75,55.63 18.8,55.63 29.21,55.63 P1.GNDVDD
  Bottom 0.406: v28.19,24.13 28.19,25.4 31.75,28.96 35.56,28.96 v37.59,26.92 37.59,22.1 41.4,18.29 44.45,18.29 46.23,20.07 v53.34,20.07 | JP9.1 JP9.2 JP9.3 JP9.4
  Bottom 1.422: P2.GNDVDD 49.53,56.39 v48.77,55.37
  Bottom 1.778: 13.97,61.21 P1.GNDMOT v13.97,55.88 12.19,55.88 11.94,56.13 5.84,56.13 | 76.45,57.15 75.18,55.88 v74.17,55.88 v72.14,55.88 70.36,55.88 69.85,56.39 P3.GNDVDD 69.85,62.48 66.04,66.29 13.72,66.29 11.94,64.52 11.94,61.47 | 9.14,61.47 5.84,58.17
  Bottom 1.93: 13.97,61.21 13.72,61.47 11.94,61.47 9.14,61.47 | JP21.2 76.45,57.15
  Bottom 2.54: 5.84,44.2 7.11,42.93 23.88,42.93 Q1.S
  Bottom 3.81: 5.84,43.69 5.84,44.2 5.84,56.13 5.84,57.4
  pour Top (isolate 0.813): 81.79,2.54 81.79,66.29 arc90 79.25,68.83 2.54,68.83 arc90 0,66.29 0,2.54 arc90 2.54,0 79.25,0 arc90
N$1
  Top 0.406: X2.3 44.38,16.33 43.43,17.27 42.89,17.27 U1.8
N$2
  Top 0.406: U1.7 41.98,17.05 X2.1
N$3
  pour Bottom (isolate 0.813): 81.79,2.54 81.79,66.29 arc90 79.25,68.83 2.54,68.83 arc90 0,66.29 0,2.54 arc90 2.54,0 79.25,0 arc90
N$4
  Top 0.406: X1.3 7.11,20.83 6.86,20.57 6.86,14.07 R3.1
N$5
  Top 1.93: Q1.D 19.05,36.32 16.51,38.86 13.46,38.86 D2.C
  Bottom 1.93: Q1.D 19.05,36.32 16.51,38.86 13.46,38.86 D2.C
  Bottom 3.81: JP20.1 4.83,38.61 13.21,38.61 D2.C
N$7
  Top 0.406: R7.2 34.39,32.66 32.26,34.8 32.26,37.31 LED1.C
N$8
  Top 0.305: IC2.10 18.35,24.97 C5.1
N$9
  Top 0.406: X1.2 7.07,21.63 6.86,21.84 6.86,23.62 6.1,24.38 6.1,27.84 R2.1
N$10
  Top 0.406: LED4.C 33.53,41.91 34.29,41.15 34.29,36.07 35.05,35.31 45.97,35.31 46.74,34.54 R1.2
N$11
  Top 0.406: R4.2 23.88,28.96 | 23.88,28.96 Q1.G 25.4,33.78 25.91,34.29 25.91,36.83 25.02,37.72 22.22,37.72 21.84,38.1 21.84,40.89 22.86,41.91 LED4.A | R11.2 23.88,28.96
N$17
  Top 0.406: LED2.C 33.27,39.62 33.53,39.37 33.53,34.8 34.29,34.04 44.45,34.04 44.7,33.78 R5.2
RESET  (via drill 0.6 pad 1.2)
  Top 0.406: U1.29 32.77,14.59 32.77,12.45 31.38,11.06 R6.1 32.54,9.65 v32.77,9.65 | 68.07,5.21 JP7.1 68.07,6.1 61.21,12.95 v53.85,12.95 53.85,15.49 54.61,16.26 54.61,20.83 53.42,22.02 S1.2
  Bottom 0.406: v32.77,9.65 39.62,9.65 40.13,10.16 51.05,10.16 v53.85,12.95
V+  (via drill 0.6 pad 1.2, 0.6 pad 1.27)
  Top 0.406: v73.91,38.61 74.42,38.1 74.42,23.11 73.66,22.35 73.66,19.56 73.15,19.05 JP22.3 JP22.4 70.48,17.4 | LED2.A 29.97,39.62 30.23,39.88 30.23,42.67 29.46,43.43 11.43,43.43 8.76,40.77 | JP22.2 JP22.1
  Top 0.813: 51.82,51.88 C13.+
  Top 1.016: C12.+ 5.84,51.82 | C23.+ 78.74,45.47 78.87,45.59 78.87,52.96 78.99,53.09 | C10.+ 31.75,51.82 P2.VMOT | P3.VMOT 52.07,51.82 C13.+
  Top 1.422: P2.VMOT 31.75,61.98 | P3.VMOT 52.07,61.47
  Top 1.778: v72.14,61.47 52.07,61.47 | 52.07,61.47 31.75,61.47 | 31.75,61.47 12.45,61.47 | 78.99,53.09 v78.99,54.36 v78.99,55.88 v78.99,57.4 78.99,58.42 77.98,59.44 73.15,59.44 72.14,60.2 v72.14,61.47 | 52.07,66.29 69.34,66.29 v70.36,65.28 v71.88,63.75 72.14,63.5 v72.14,61.47 | 52.07,66.29 52.07,61.47 | 52.07,66.29 31.75,66.29 | 31.75,66.29 10.67,66.29 arc90 10.41,66.04 10.41,65.28 | 31.75,66.29 31.75,61.98 31.75,61.47 | P1.VMOT 9.14,58.67
  Top 3.81: v8.89,34.04 8.89,40.64 8.76,40.77 5.84,43.69 5.84,51.82 5.84,58.67 9.14,58.67 10.41,58.67 10.41,65.28
  Bottom 0.406: JP22.1 JP22.2 JP22.3 JP22.4 | v73.91,38.61 73.91,41.15 76.45,43.69 JP21.1
  Bottom 1.778: v78.99,54.36 78.99,54.86 v78.99,55.88 v78.99,57.4 78.99,58.42 77.98,59.44 73.15,59.44 72.14,60.2 v72.14,61.47 72.14,63.5 v71.88,63.75 v70.36,65.28
  Bottom 2.54: JP21.1 78.87,52.07 78.99,52.2 78.99,54.86
  Bottom 3.81: JP20.2 8.81,34.12 v8.89,34.04 D2.A
X-MOT-1A
  Bottom 1.016: JP10.3 P1.1A
X-MOT-1A1
  Bottom 1.016: JP2.3 P2.1A
X-MOT-1A2
  Bottom 1.016: JP16.3 P3.1A
X-MOT-1B
  Bottom 1.016: JP10.4 P1.1B
X-MOT-1B1
  Bottom 1.016: JP2.4 P2.1B
X-MOT-1B2
  Bottom 1.016: JP16.4 P3.1B
X-MOT-2A
  Bottom 1.016: JP10.2 P1.2A
X-MOT-2A1
  Bottom 1.016: JP2.2 P2.2A
X-MOT-2A2
  Bottom 1.016: P3.2A JP16.2
X-MOT-2B
  Bottom 1.016: JP10.1 P1.2B
X-MOT-2B1
  Bottom 1.016: P2.2B JP2.1
X-MOT-2B2
  Bottom 1.016: P3.2B JP16.1
X-MS1
  Top 0.406: R10.2 21.44,50.65 JP11.1
  Bottom 0.406: P1.MS1 17.02,49.02 20.83,49.02 21.59,49.78 JP11.1
X-MS2
  Bottom 0.406: P1.MS2 18.8,48.26 23.37,48.26 24.13,49.02 JP12.1
X-MS3
  Bottom 0.406: P1.MS3 20.57,47.5 25.91,47.5 26.67,48.26 JP13.1
X-MS4
  Bottom 0.406: P2.MS2 39.37,48.51 43.69,48.51 44.45,49.28 JP14.1
X-MS5
  Bottom 0.406: P2.MS3 41.15,47.75 45.97,47.75 46.99,48.77 JP15.1
X-MS6  (via drill 0.6 pad 1.2)
  Top 0.406: R8.2 31.09,32.36 v31.11,33.02
  Bottom 0.406: JP3.1 41.91,50.29 40.89,49.28 37.59,49.28 P2.MS1 34.29,43.43 31.24,40.39 31.24,33.15 v31.11,33.02
X-MS7
  Bottom 0.406: P3.MS2 59.44,48.26 63.5,48.26 64.77,49.53 JP18.1
X-MS8
  Bottom 0.406: P3.MS3 61.21,47.5 66.04,47.5 67.31,48.77 JP19.1
X-MS9
  Top 0.406: R9.2 39.27,31.24 48.01,31.24 48.77,32 48.77,41.91 50.55,43.69 53.85,43.69 54.61,44.45 P3.MS1
  Bottom 0.406: P3.MS1 57.66,49.02 61.21,49.02 62.23,50.04 JP17.1
X-RESETSLEEP
  Bottom 1.016: P1.!SLP P1.!RST
X-RESETSLEEP1
  Bottom 1.016: P2.!SLP P2.!RST
X-RESETSLEEP2
  Bottom 1.016: P3.!SLP P3.!RST
(copper drawn outside any net)
  shapes: Top circle x1

### Text on the board
tPlace: X | Y | Z | GND | 12V | Spindle ON | 12V Power | CYCLNE | 5V Power | Z | Ver. 1.1 | GRBL | (c) 2013 | X | CNTRL | !RST! | Y | 12V | MOSI | MISO | SCK | !RST! | ISP | D11...13 | GND | 5V | A0 | A1 | A2 | A3 | A4 | A5 | A6 | A7 | D0 | D1 | D2 | D3 | D4 | D5 | D6 | D7 | D8 | D9 | D10 | D11 | D12 | D13 | RST